# Altium schematic sheet Sources.SchDoc
size A4; SheetNumber: 7; SheetTotal: 7
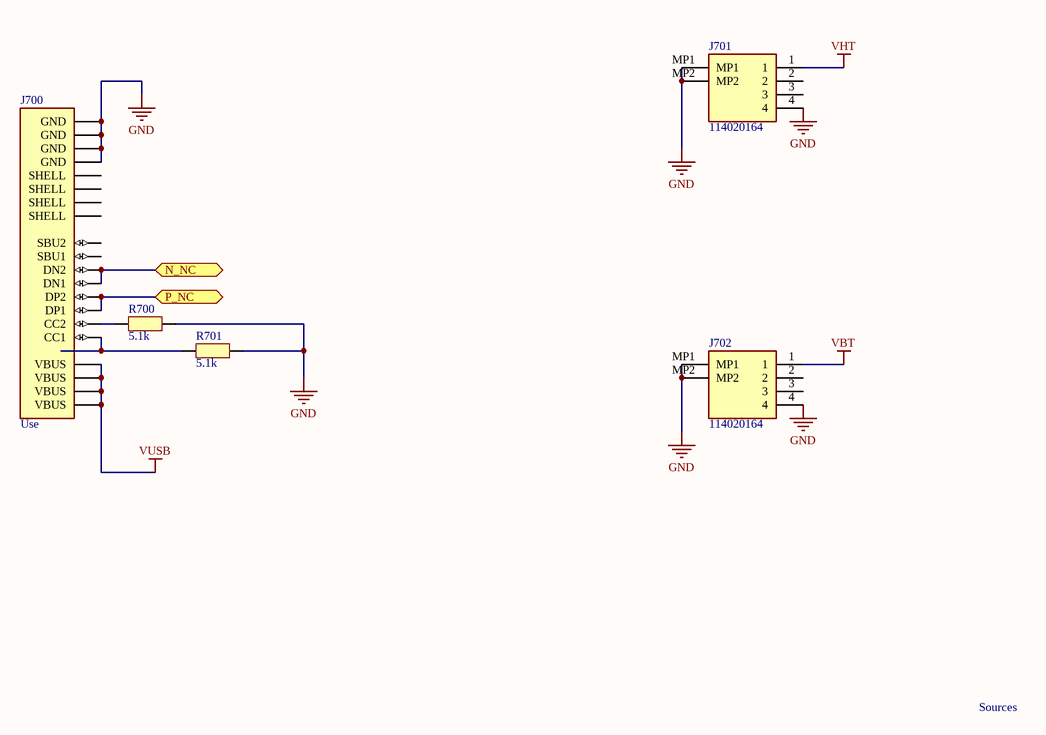
[diagram p0: Sources.SchDoc]

## Parts
J700  Use  [USB4085-GF-A]
J701  114020164  [114020164]
J702  114020164  [114020164]
R700  5.1k  [RESC1005X06N]
R701  5.1k  [RESC1005X06N]

## Ports
N_NC (bidir), P_NC (bidir)

## Nets
GND: J700.A1(GND) J700.A12(GND) J700.B1(GND) J700.B12(GND) J701.4 J701.MP1 J701.MP2 J702.4 J702.MP1 J702.MP2 R700.2 R701.2
VBT: J702.1
VHT: J701.1
VUSB: J700.A4(VBUS) J700.A9(VBUS) J700.B4(VBUS) J700.B9(VBUS)
N_NC: J700.A7(DN1) J700.B7(DN2) ; port N_NC
P_NC: J700.A6(DP1) J700.B6(DP2) ; port P_NC
NetJ700_A5: J700.A5(CC1) R701.1
NetJ700_B5: J700.B5(CC2) R700.1

Not connected (* = marked no-connect by the designer): J700 A8(SBU1) B8(SBU2) S1(SHELL) S2(SHELL) S3(SHELL) S4(SHELL); J701 2 3; J702 2 3

## Notes on the sheet
- Sources

## Library data of the parts
J700 = USB4085-GF-A: Connecteurs USB USB Type C, 2.0, Rec, TH , G/F, RA , Top Mnt, T & R
J701 J702 = 114020164: Seeed Studio Accessories Grove Female Header - SMD-4P-2.0mm-90D-20Pcs; Manufacturer_Name: Seeed Studio; Manufacturer_Part_Number: 114020164; Mouser Part Number: 713-114020164
R700 R701 = Resistor